# EAGLE design DATALOGGER_BP_V1 (EAGLE 9.5.2)

## Sheet 1 of 4
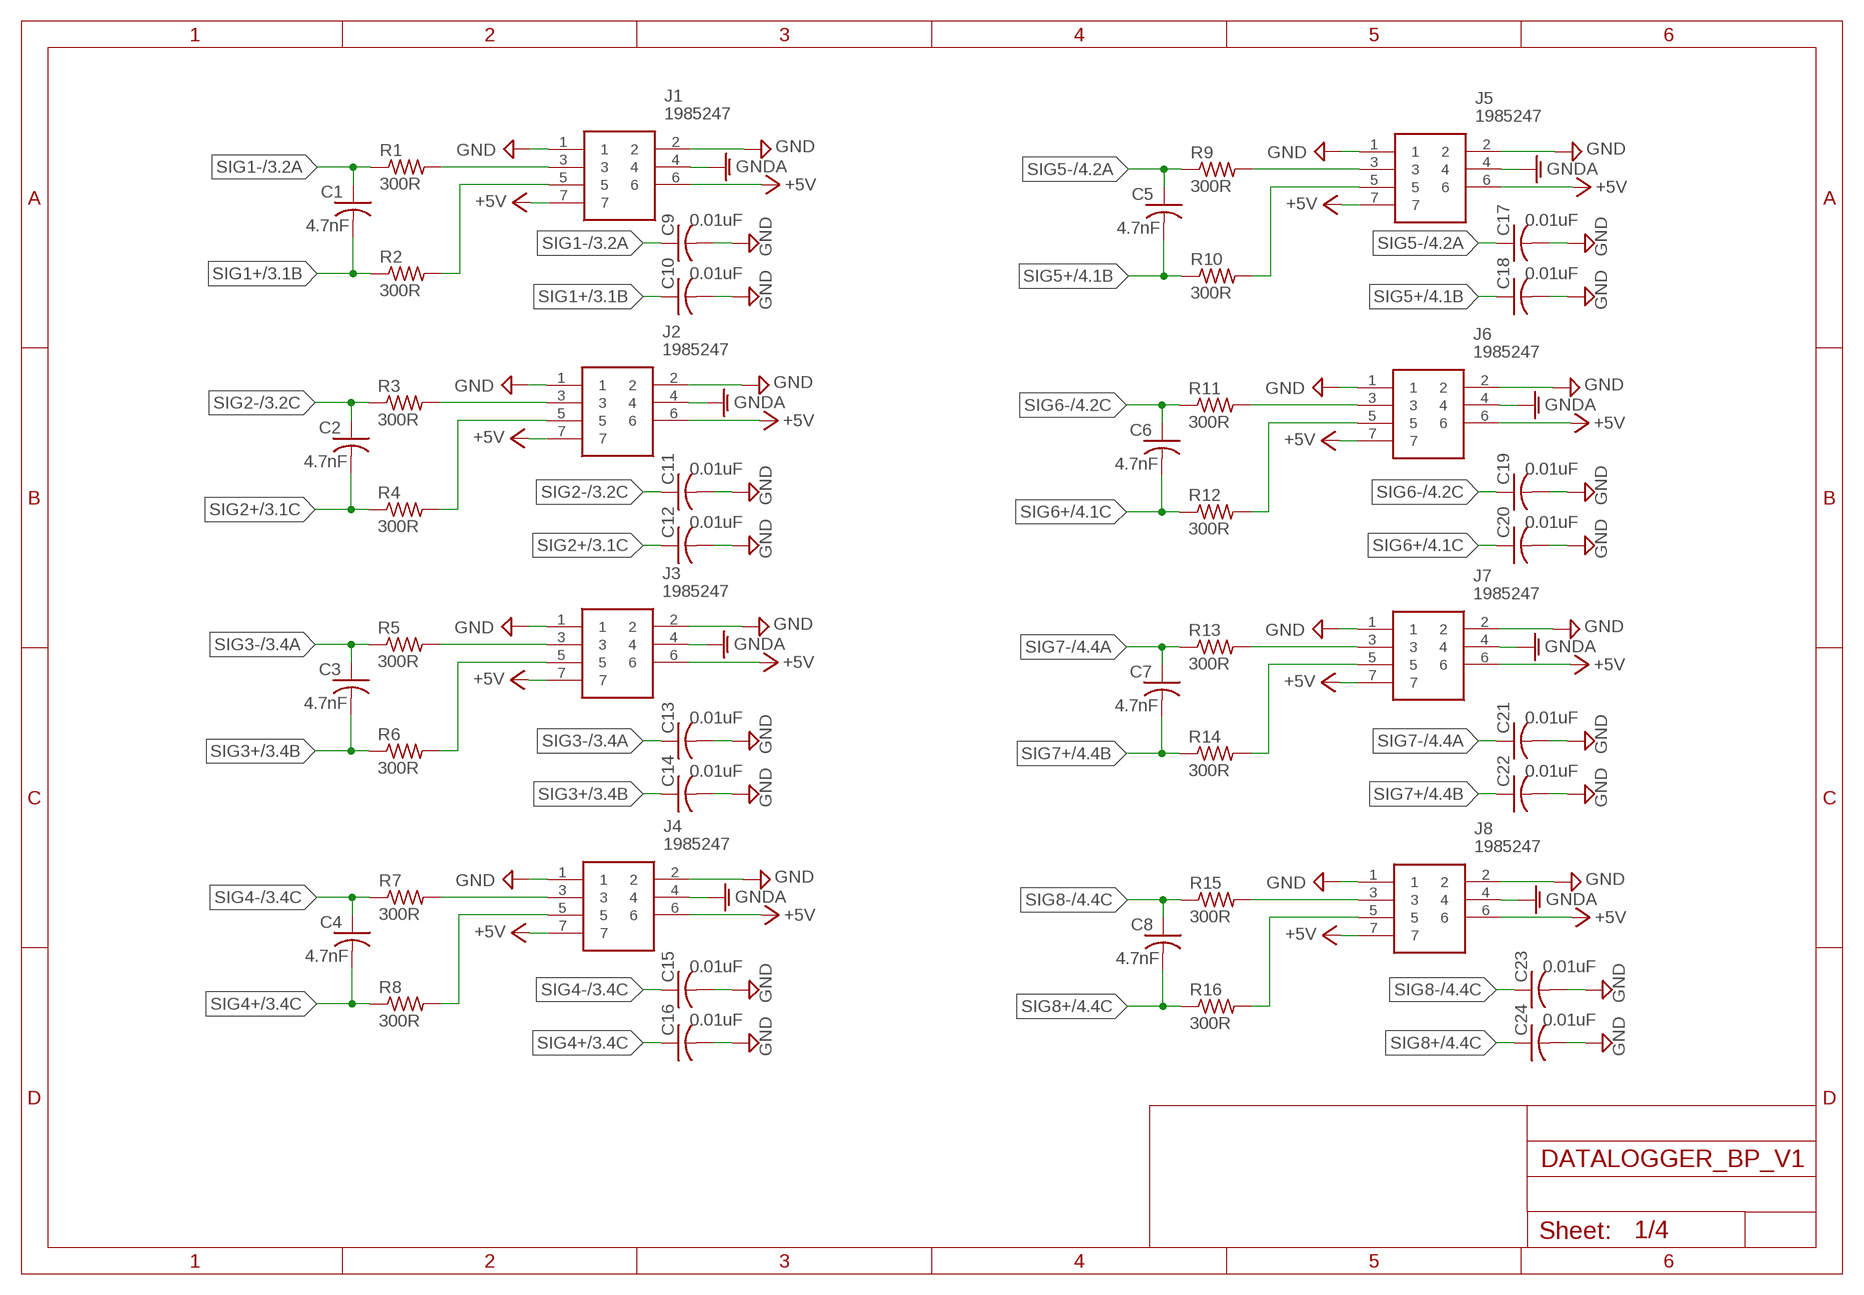
[diagram p0: schematic, sheet 1]

### Parts
C1  4.7nF  C-USC0805  [C0805]
C2  4.7nF  C-USC0805  [C0805]
C3  4.7nF  C-USC0805  [C0805]
C4  4.7nF  C-USC0805  [C0805]
C5  4.7nF  C-USC0805  [C0805]
C6  4.7nF  C-USC0805  [C0805]
C7  4.7nF  C-USC0805  [C0805]
C8  4.7nF  C-USC0805  [C0805]
C9  0.01uF  C-USC0805  [C0805]
C10  0.01uF  C-USC0805  [C0805]
C11  0.01uF  C-USC0805  [C0805]
C12  0.01uF  C-USC0805  [C0805]
C13  0.01uF  C-USC0805  [C0805]
C14  0.01uF  C-USC0805  [C0805]
C15  0.01uF  C-USC0805  [C0805]
C16  0.01uF  C-USC0805  [C0805]
C17  0.01uF  C-USC0805  [C0805]
C18  0.01uF  C-USC0805  [C0805]
C19  0.01uF  C-USC0805  [C0805]
C20  0.01uF  C-USC0805  [C0805]
C21  0.01uF  C-USC0805  [C0805]
C22  0.01uF  C-USC0805  [C0805]
C23  0.01uF  C-USC0805  [C0805]
C24  0.01uF  C-USC0805  [C0805]
J1  1985247  [1985247]
J2  1985247  [1985247]
J3  1985247  [1985247]
J4  1985247  [1985247]
J5  1985247  [1985247]
J6  1985247  [1985247]
J7  1985247  [1985247]
J8  1985247  [1985247]
R1  300R  R-US_R0805  [R0805]
R2  300R  R-US_R0805  [R0805]
R3  300R  R-US_R0805  [R0805]
R4  300R  R-US_R0805  [R0805]
R5  300R  R-US_R0805  [R0805]
R6  300R  R-US_R0805  [R0805]
R7  300R  R-US_R0805  [R0805]
R8  300R  R-US_R0805  [R0805]
R9  300R  R-US_R0805  [R0805]
R10  300R  R-US_R0805  [R0805]
R11  300R  R-US_R0805  [R0805]
R12  300R  R-US_R0805  [R0805]
R13  300R  R-US_R0805  [R0805]
R14  300R  R-US_R0805  [R0805]
R15  300R  R-US_R0805  [R0805]
R16  300R  R-US_R0805  [R0805]

### Nets
+5V: J1.6 J1.7 J2.6 J2.7 J3.6 J3.7 J4.6 J4.7 J5.6 J5.7 J6.6 J6.7 J7.6 J7.7 J8.6 J8.7 ; also sheet 2
GND: C9.2 C10.2 C11.2 C12.2 C13.2 C14.2 C15.2 C16.2 C17.2 C18.2 C19.2 C20.2 C21.2 C22.2 C23.2 C24.2 J1.1 J1.2 J2.1 J2.2 J3.1 J3.2 J4.1 J4.2 J5.1 J5.2 J6.1 J6.2 J7.1 J7.2 J8.1 J8.2 ; also sheet 2,3,4
GNDA: J1.4 J2.4 J3.4 J4.4 J5.4 J6.4 J7.4 J8.4 ; also sheet 2
N$1: J1.3 R1.2
N$2: J1.5 R2.2
N$3: J2.3 R3.2
N$4: J2.5 R4.2
N$5: J3.3 R5.2
N$6: J3.5 R6.2
N$7: J4.3 R7.2
N$8: J4.5 R8.2
N$9: J5.3 R9.2
N$10: J5.5 R10.2
N$11: J6.3 R11.2
N$12: J6.5 R12.2
N$13: J7.3 R13.2
N$14: J7.5 R14.2
N$15: J8.3 R15.2
N$16: J8.5 R16.2
SIG1+: C1.2 C10.1 R2.1 ; also sheet 3
SIG1-: C1.1 C9.1 R1.1 ; also sheet 3
SIG2+: C2.2 C12.1 R4.1 ; also sheet 3
SIG2-: C2.1 C11.1 R3.1 ; also sheet 3
SIG3+: C3.2 C14.1 R6.1 ; also sheet 3
SIG3-: C3.1 C13.1 R5.1 ; also sheet 3
SIG4+: C4.2 C16.1 R8.1 ; also sheet 3
SIG4-: C4.1 C15.1 R7.1 ; also sheet 3
SIG5+: C5.2 C18.1 R10.1 ; also sheet 4
SIG5-: C5.1 C17.1 R9.1 ; also sheet 4
SIG6+: C6.2 C20.1 R12.1 ; also sheet 4
SIG6-: C6.1 C19.1 R11.1 ; also sheet 4
SIG7+: C7.2 C22.1 R14.1 ; also sheet 4
SIG7-: C7.1 C21.1 R13.1 ; also sheet 4
SIG8+: C8.2 C24.1 R16.1 ; also sheet 4
SIG8-: C8.1 C23.1 R15.1 ; also sheet 4

## Sheet 2 of 4
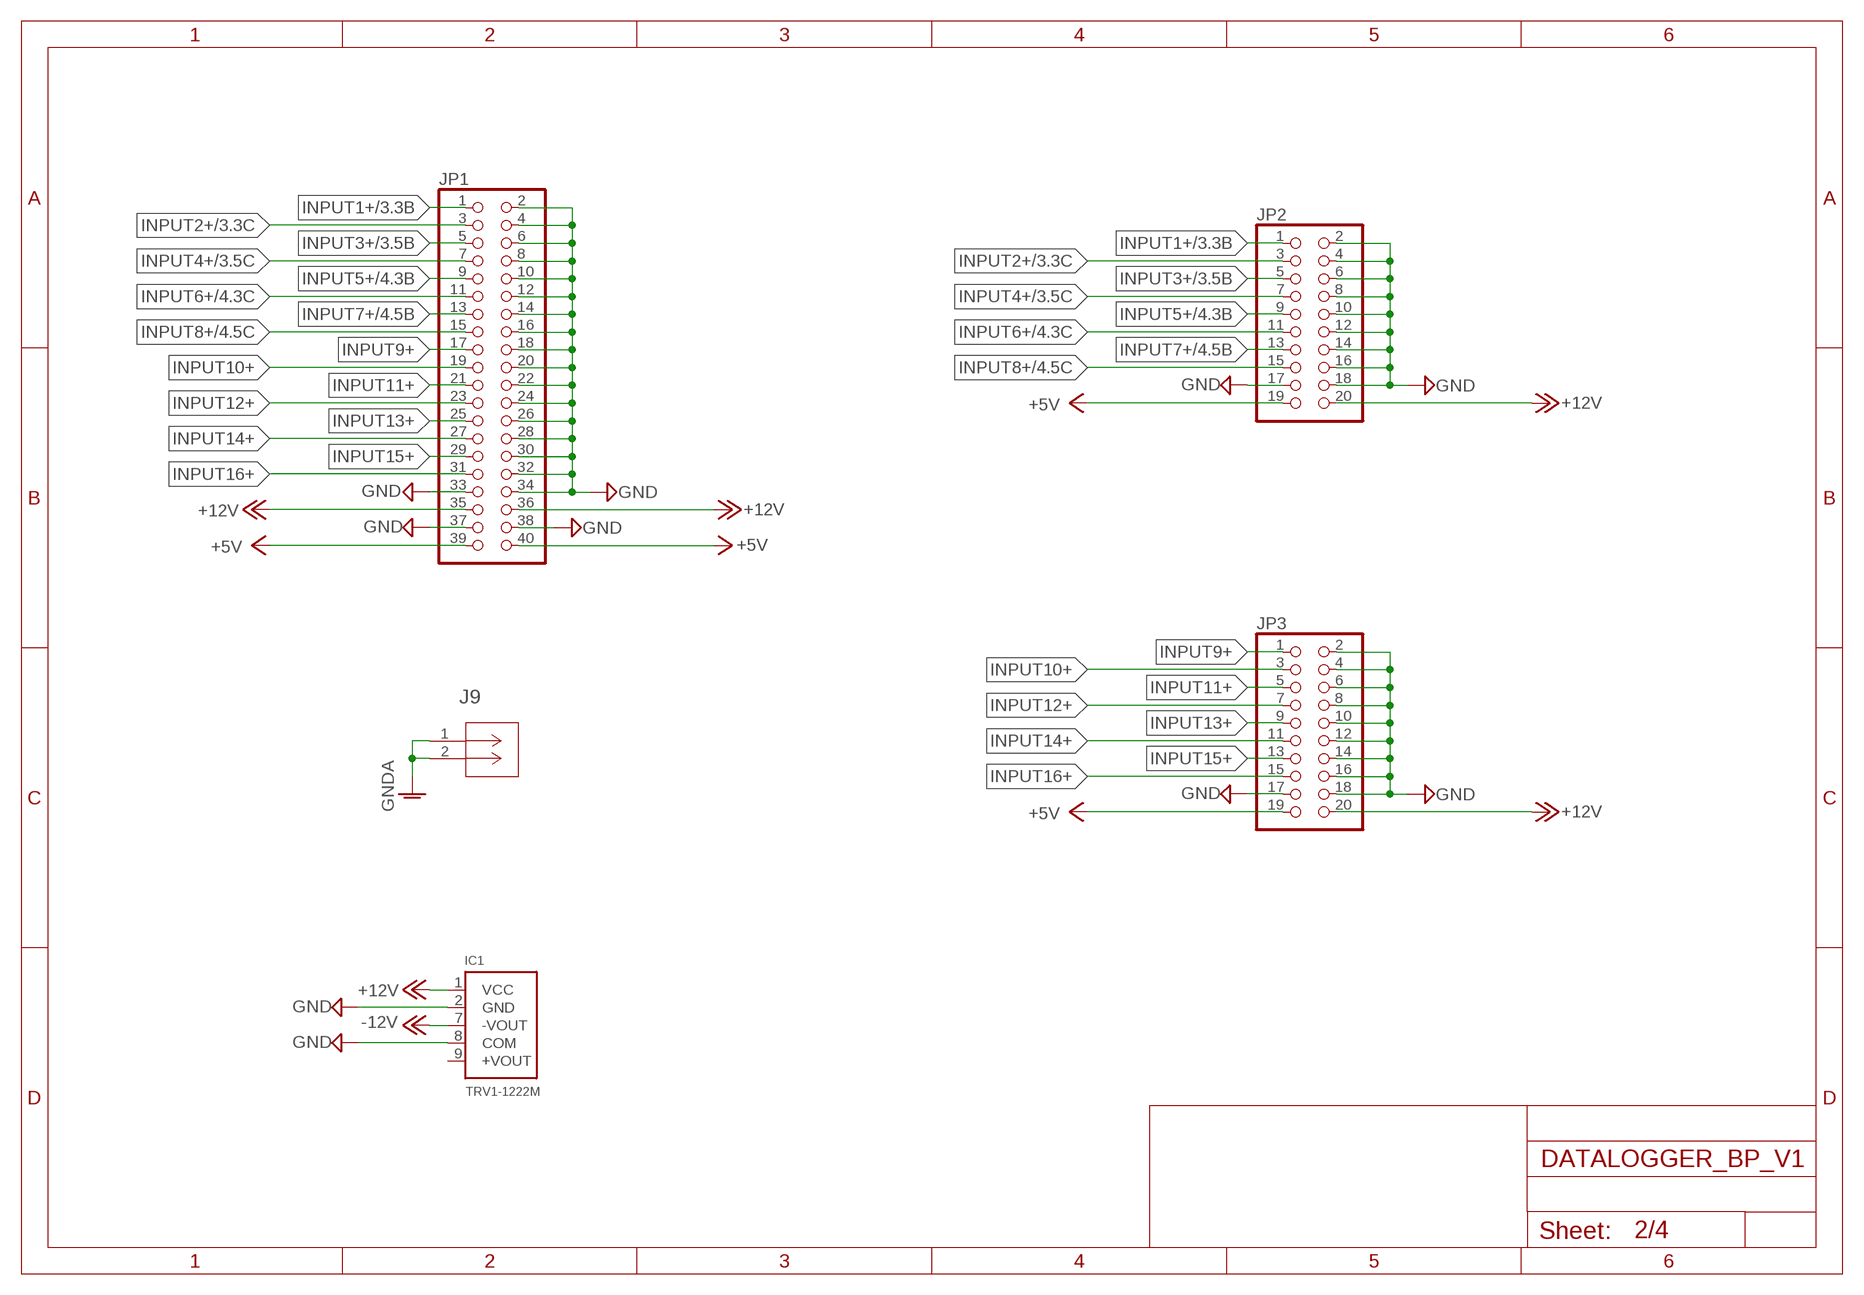
[diagram p1: schematic, sheet 2]

### Parts
IC1  TRV1-1222M  [TRV1-1222M]
J9  1755736  [CONN_1924305]
JP1  PINHD-2X20  [2X20]
JP2  PINHD-2X10  [2X10]
JP3  PINHD-2X10  [2X10]

### Nets
+5V: JP1.39 JP1.40 JP2.19 JP3.19 ; also sheet 1
+12V: IC1.1(VCC) JP1.35 JP1.36 JP2.20 JP3.20 ; also sheet 3,4
-12V: IC1.7(-VOUT) ; also sheet 3,4
GND: IC1.2(GND) IC1.8(COM) JP1.2 JP1.4 JP1.6 JP1.8 JP1.10 JP1.12 JP1.14 JP1.16 JP1.18 JP1.20 JP1.22 JP1.24 JP1.26 JP1.28 JP1.30 JP1.32 JP1.33 JP1.34 JP1.37 JP1.38 JP2.2 JP2.4 JP2.6 JP2.8 JP2.10 JP2.12 JP2.14 JP2.16 JP2.17 JP2.18 JP3.2 JP3.4 JP3.6 JP3.8 JP3.10 JP3.12 JP3.14 JP3.16 JP3.17 JP3.18 ; also sheet 1,3,4
GNDA: J9.1 J9.2 ; also sheet 1
INPUT1+: JP1.1 JP2.1 ; also sheet 3
INPUT2+: JP1.3 JP2.3 ; also sheet 3
INPUT3+: JP1.5 JP2.5 ; also sheet 3
INPUT4+: JP1.7 JP2.7 ; also sheet 3
INPUT5+: JP1.9 JP2.9 ; also sheet 4
INPUT6+: JP1.11 JP2.11 ; also sheet 4
INPUT7+: JP1.13 JP2.13 ; also sheet 4
INPUT8+: JP1.15 JP2.15 ; also sheet 4
INPUT9+: JP1.17 JP3.1
INPUT10+: JP1.19 JP3.3
INPUT11+: JP1.21 JP3.5
INPUT12+: JP1.23 JP3.7
INPUT13+: JP1.25 JP3.9
INPUT14+: JP1.27 JP3.11
INPUT15+: JP1.29 JP3.13
INPUT16+: JP1.31 JP3.15
Unconnected: IC1.9(+VOUT)

## Sheet 3 of 4
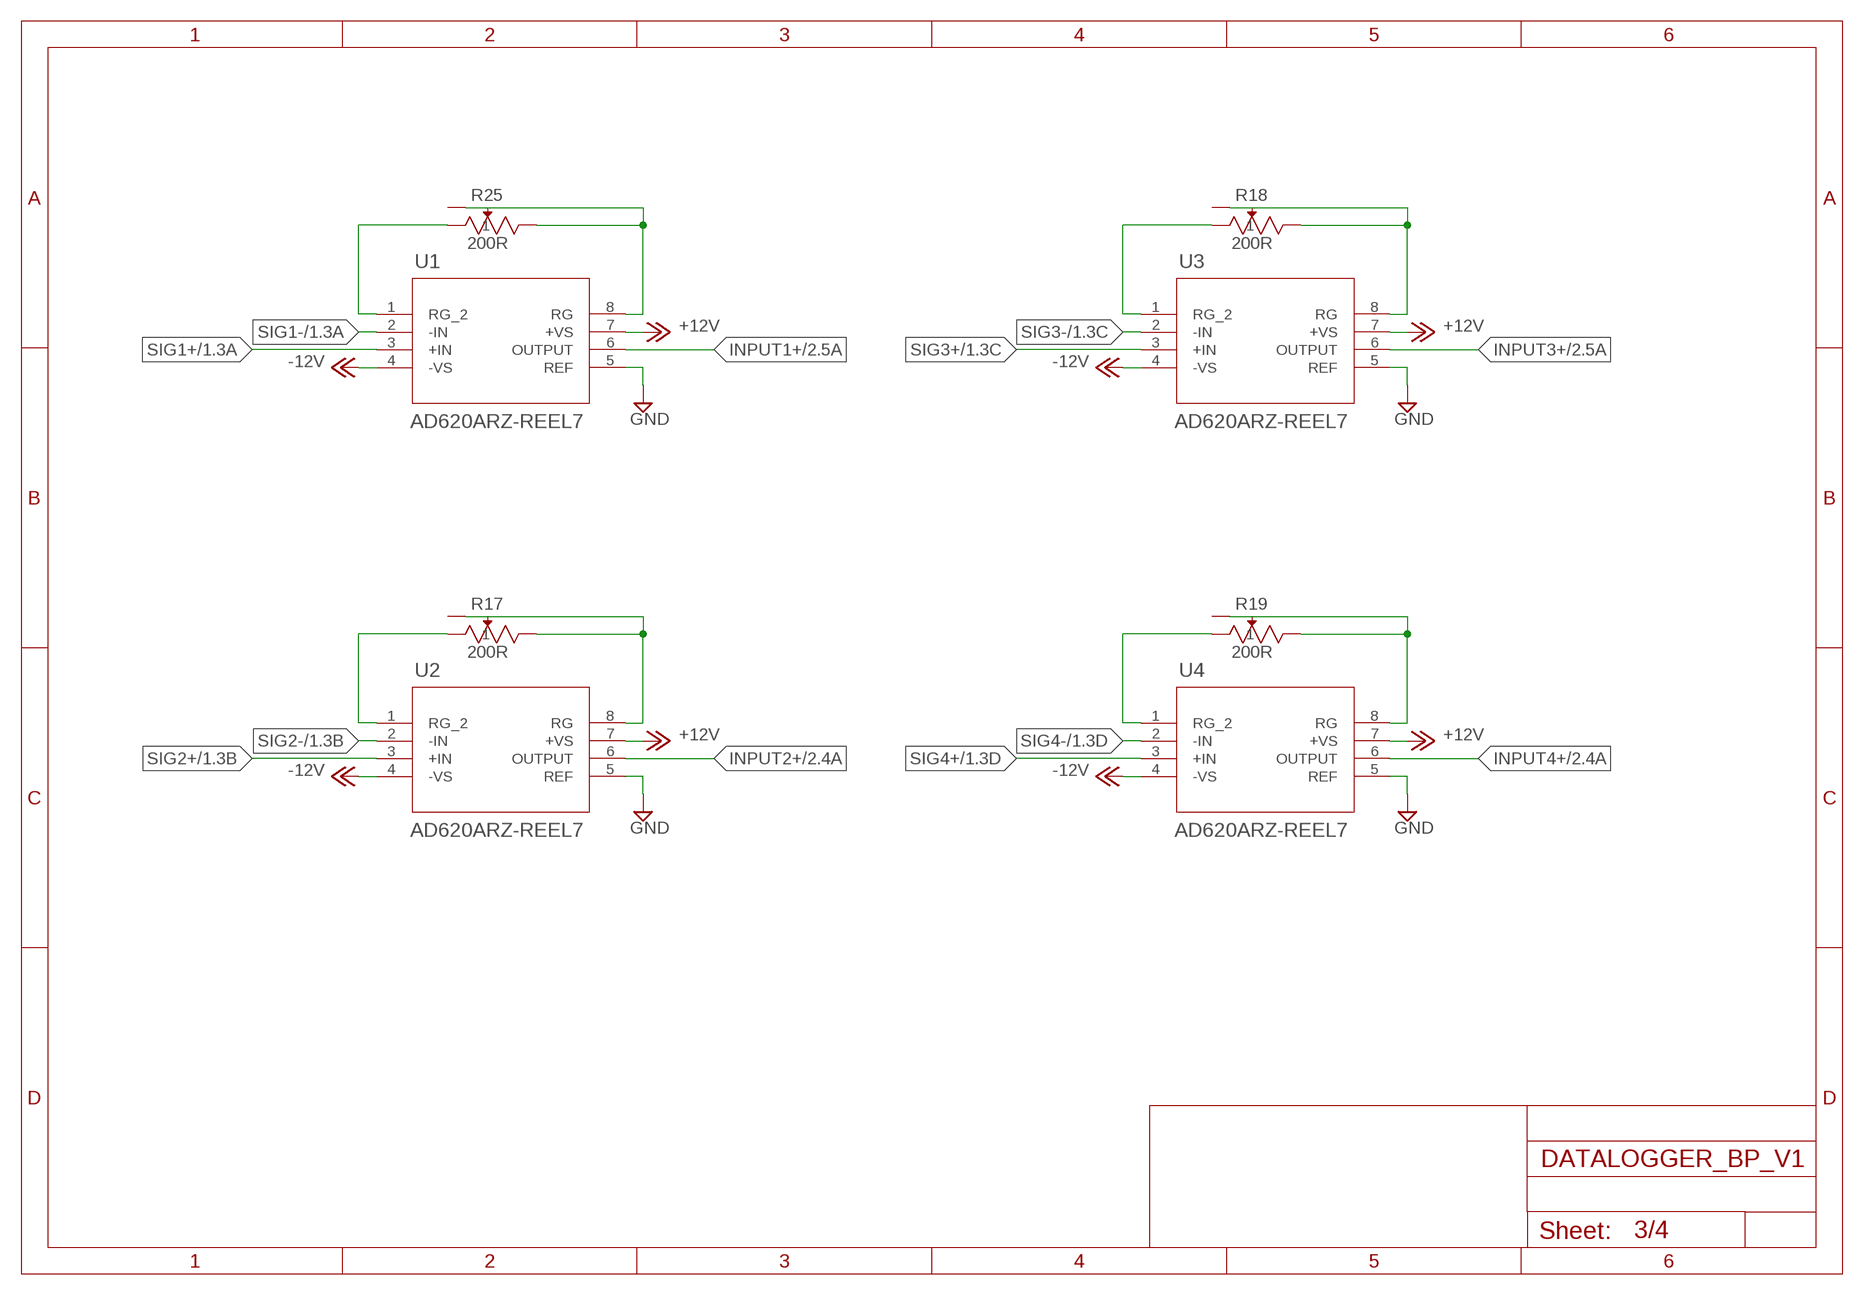
[diagram p2: schematic, sheet 3]

### Parts
R17  200R  22AR200LFTR  [RES3_22A_TTE]
R18  200R  22AR200LFTR  [RES3_22A_TTE]
R19  200R  22AR200LFTR  [RES3_22A_TTE]
R25  200R  22AR200LFTR  [RES3_22A_TTE]
U1  AD620ARZ-REEL7  [R_8_ADI]
U2  AD620ARZ-REEL7  [R_8_ADI]
U3  AD620ARZ-REEL7  [R_8_ADI]
U4  AD620ARZ-REEL7  [R_8_ADI]

### Nets
+12V: U1.7(+VS) U2.7(+VS) U3.7(+VS) U4.7(+VS) ; also sheet 2,4
-12V: U1.4(-VS) U2.4(-VS) U3.4(-VS) U4.4(-VS) ; also sheet 2,4
GND: U1.5(REF) U2.5(REF) U3.5(REF) U4.5(REF) ; also sheet 1,2,4
INPUT1+: U1.6(OUTPUT) ; also sheet 2
INPUT2+: U2.6(OUTPUT) ; also sheet 2
INPUT3+: U3.6(OUTPUT) ; also sheet 2
INPUT4+: U4.6(OUTPUT) ; also sheet 2
N$17: R25.1 U1.1(RG_2)
N$18: R25.2 R25.3 U1.8(RG)
N$19: R17.1 U2.1(RG_2)
N$20: R17.2 R17.3 U2.8(RG)
N$21: R18.1 U3.1(RG_2)
N$22: R18.2 R18.3 U3.8(RG)
N$23: R19.1 U4.1(RG_2)
N$24: R19.2 R19.3 U4.8(RG)
SIG1+: U1.3(+IN) ; also sheet 1
SIG1-: U1.2(-IN) ; also sheet 1
SIG2+: U2.3(+IN) ; also sheet 1
SIG2-: U2.2(-IN) ; also sheet 1
SIG3+: U3.3(+IN) ; also sheet 1
SIG3-: U3.2(-IN) ; also sheet 1
SIG4+: U4.3(+IN) ; also sheet 1
SIG4-: U4.2(-IN) ; also sheet 1

## Sheet 4 of 4
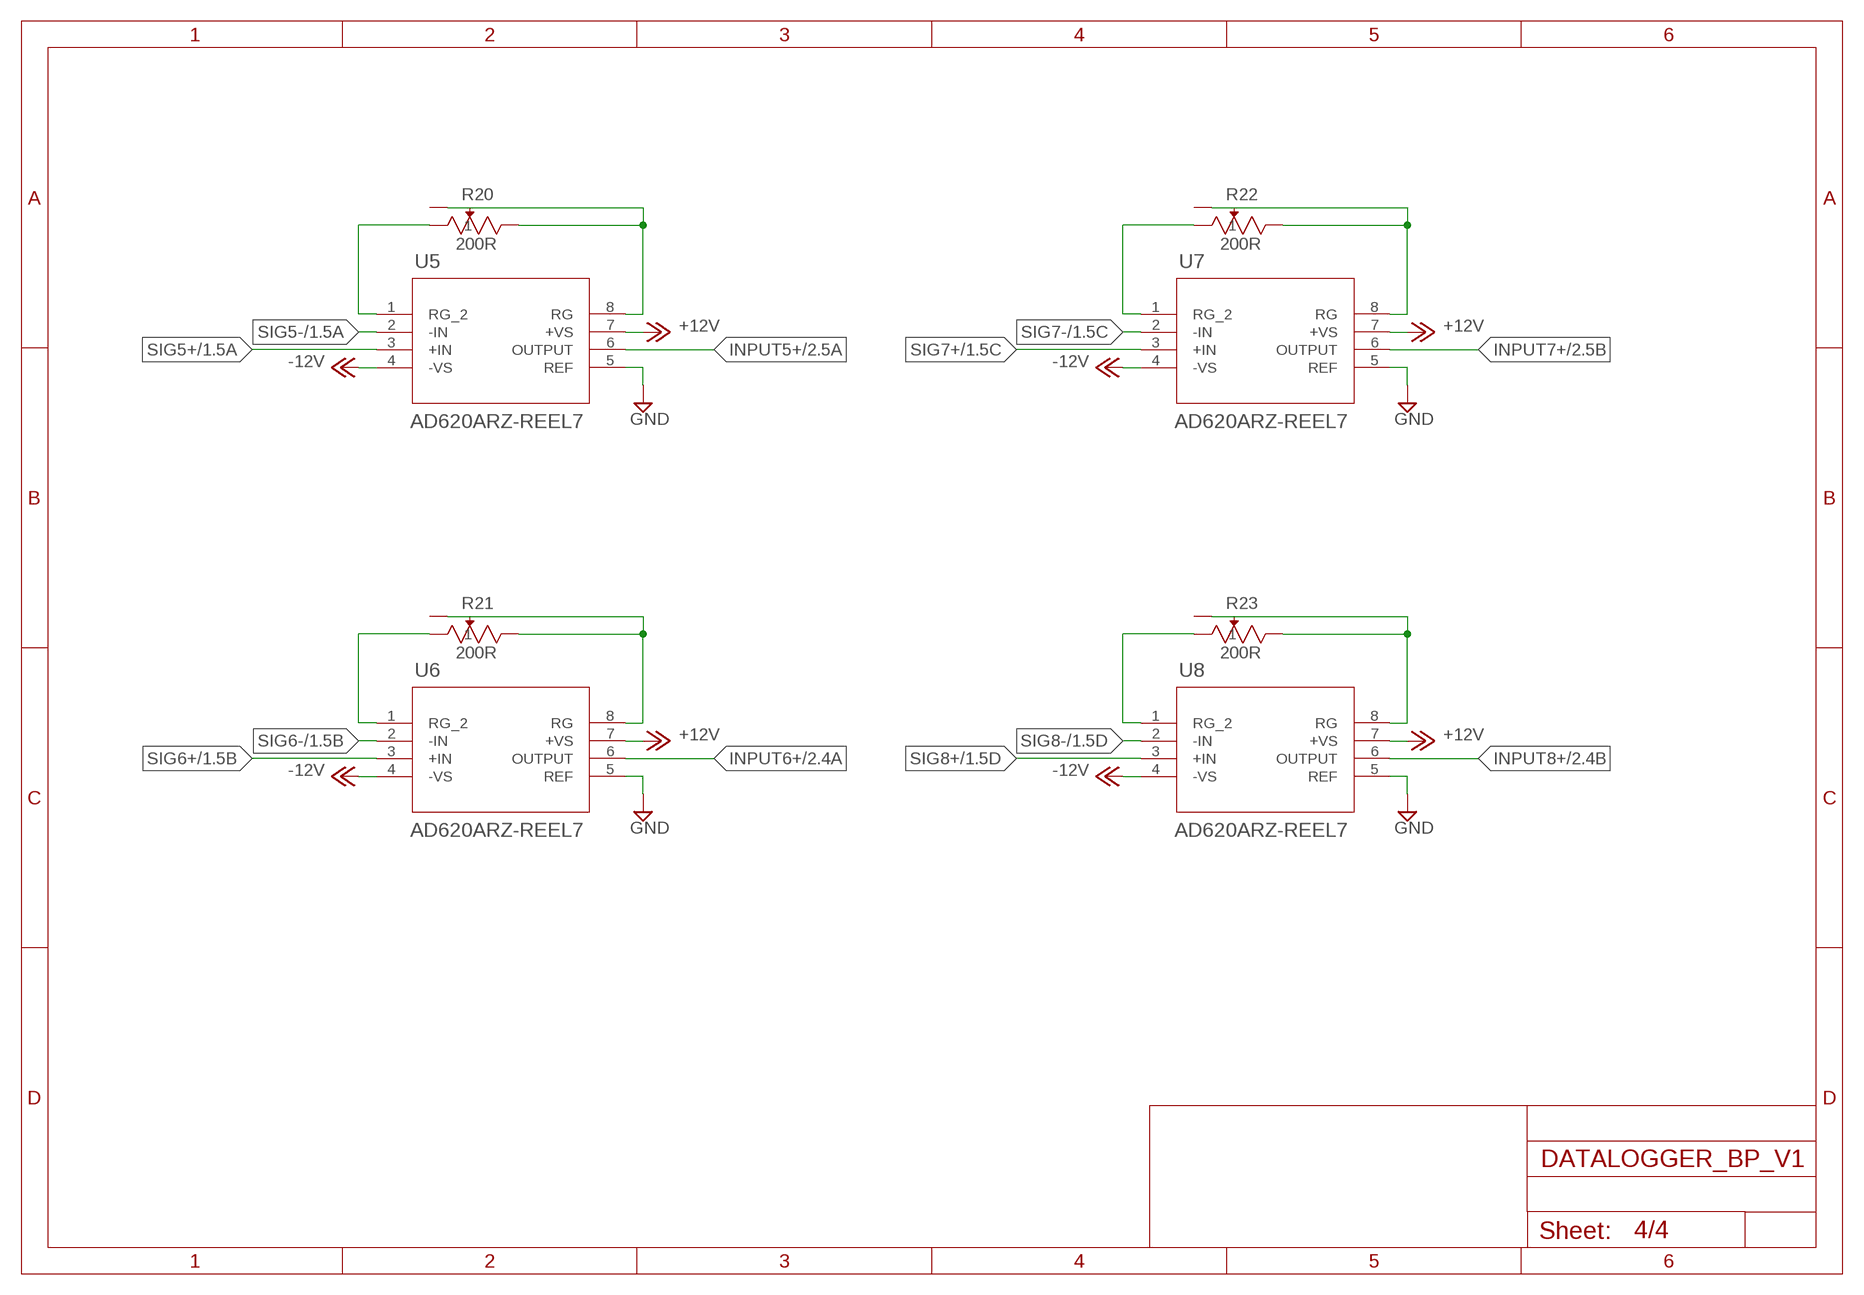
[diagram p3: schematic, sheet 4]

### Parts
R20  200R  22AR200LFTR  [RES3_22A_TTE]
R21  200R  22AR200LFTR  [RES3_22A_TTE]
R22  200R  22AR200LFTR  [RES3_22A_TTE]
R23  200R  22AR200LFTR  [RES3_22A_TTE]
U5  AD620ARZ-REEL7  [R_8_ADI]
U6  AD620ARZ-REEL7  [R_8_ADI]
U7  AD620ARZ-REEL7  [R_8_ADI]
U8  AD620ARZ-REEL7  [R_8_ADI]

### Nets
+12V: U5.7(+VS) U6.7(+VS) U7.7(+VS) U8.7(+VS) ; also sheet 2,3
-12V: U5.4(-VS) U6.4(-VS) U7.4(-VS) U8.4(-VS) ; also sheet 2,3
GND: U5.5(REF) U6.5(REF) U7.5(REF) U8.5(REF) ; also sheet 1,2,3
INPUT5+: U5.6(OUTPUT) ; also sheet 2
INPUT6+: U6.6(OUTPUT) ; also sheet 2
INPUT7+: U7.6(OUTPUT) ; also sheet 2
INPUT8+: U8.6(OUTPUT) ; also sheet 2
N$25: R20.1 U5.1(RG_2)
N$26: R20.2 R20.3 U5.8(RG)
N$27: R21.1 U6.1(RG_2)
N$28: R21.2 R21.3 U6.8(RG)
N$29: R22.1 U7.1(RG_2)
N$30: R22.2 R22.3 U7.8(RG)
N$31: R23.1 U8.1(RG_2)
N$32: R23.2 R23.3 U8.8(RG)
SIG5+: U5.3(+IN) ; also sheet 1
SIG5-: U5.2(-IN) ; also sheet 1
SIG6+: U6.3(+IN) ; also sheet 1
SIG6-: U6.2(-IN) ; also sheet 1
SIG7+: U7.3(+IN) ; also sheet 1
SIG7-: U7.2(-IN) ; also sheet 1
SIG8+: U8.3(+IN) ; also sheet 1
SIG8-: U8.2(-IN) ; also sheet 1

## Library data of the parts
C1-C24 = rcl:C-US: CAPACITOR, American symbol; SPICEPREFIX: C
IC1 = TRV 1-1222M:TRV1-1222M
J1-J8 = SamacSys_Parts:1985247: Fixed Terminal Blocks PTSA 1.5/7-3.5-Z Source: Datasheet <https://www.phoenixcontact.com/online/portal/us?uri=pxc-oc-itemdetail:pid=1985247&library=usen&tab=1>; DESCRIPTION: Fixed Terminal Blocks PTSA 1.5/7-3.5-Z; HEIGHT: 13.1mm; MANUFACTURER_NAME: Phoenix Contact; MANUFACTURER_PART_NUMBER: 1985247; MOUSER_PART_NUMBER: 651-1985247; MOUSER_PRICE-STOCK: https://www.mouser.com/Search/Refine.aspx?Keyword=651-1985247
J9 = 1755736:1755736; ARTICLE_DESCRIPTION: MSTBVA 2,5/ 2-G-5,08; BUILT_BY: EMA_Anthony; CONTACT_TYPE: male connector; COPYRIGHT: Copyright (C) 2018 Accelerated Designs. All rights reserved; MANUFACTURER_PART_NUMBER: 1755736; NUMBER_OF_CONNECTION: 2; NUMBER_OF_POSITION_PER_ROW: 2; NUMBER_OF_POTENTIALS: 2; NUMBER_OF_ROWS: 1; NUMBER_OF_SOLDER_PINS_PER_POTENTIALS: 1; PITCH__MM_: 5.08; PLUG_SYSTEM: CLASSIC COMBICON; PRODUCTTYP: PCB headers; PRODUCT_FAMILY: MSTBVA 2,5/..-G; SOLDER_PIN_LENGTH__MM_: 3.9; SOURCELIBRARY: Phoenix_Contact_2020-08-21; VENDOR: Phoenix Contact
JP1 = pinhead:PINHD-2X20: PIN HEADER
JP2 JP3 = pinhead:PINHD-2X10: PIN HEADER
R1-R16 = rcl:R-US_: RESISTOR, American symbol; SPICEPREFIX: R
R17-R23 R25 = 22AR200LFTR:22AR200LFTR; COPYRIGHT: Copyright (C) 2016 Accelerated Designs. All rights reserved; MANUFACTURER_PART_NUMBER: 22AR200LFTR; SOURCELIBRARY: TTELECTRONICS_2018-04-11; VENDOR: TT Electronics
U1-U8 = AD620ARZ-REEL7:AD620ARZ-REEL7; BUILT_BY: EMA_UL_Team; MANUFACTURER_PART_NUMBER: AD620ARZ-REEL7; SOURCELIBRARY: Analog_2012-01-01_3; VENDOR: Analog Devices Inc

## Board
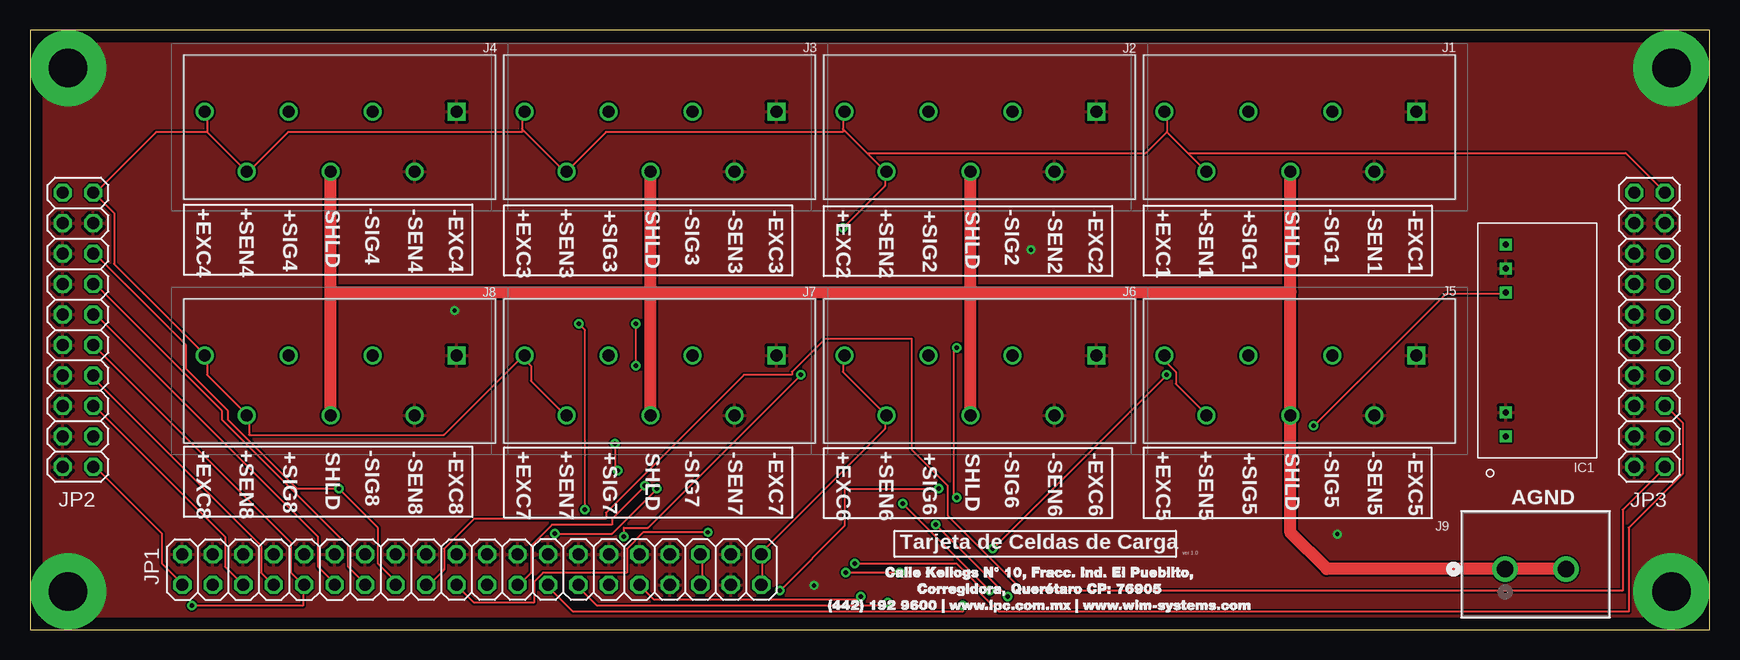
[diagram p4: board, top side]
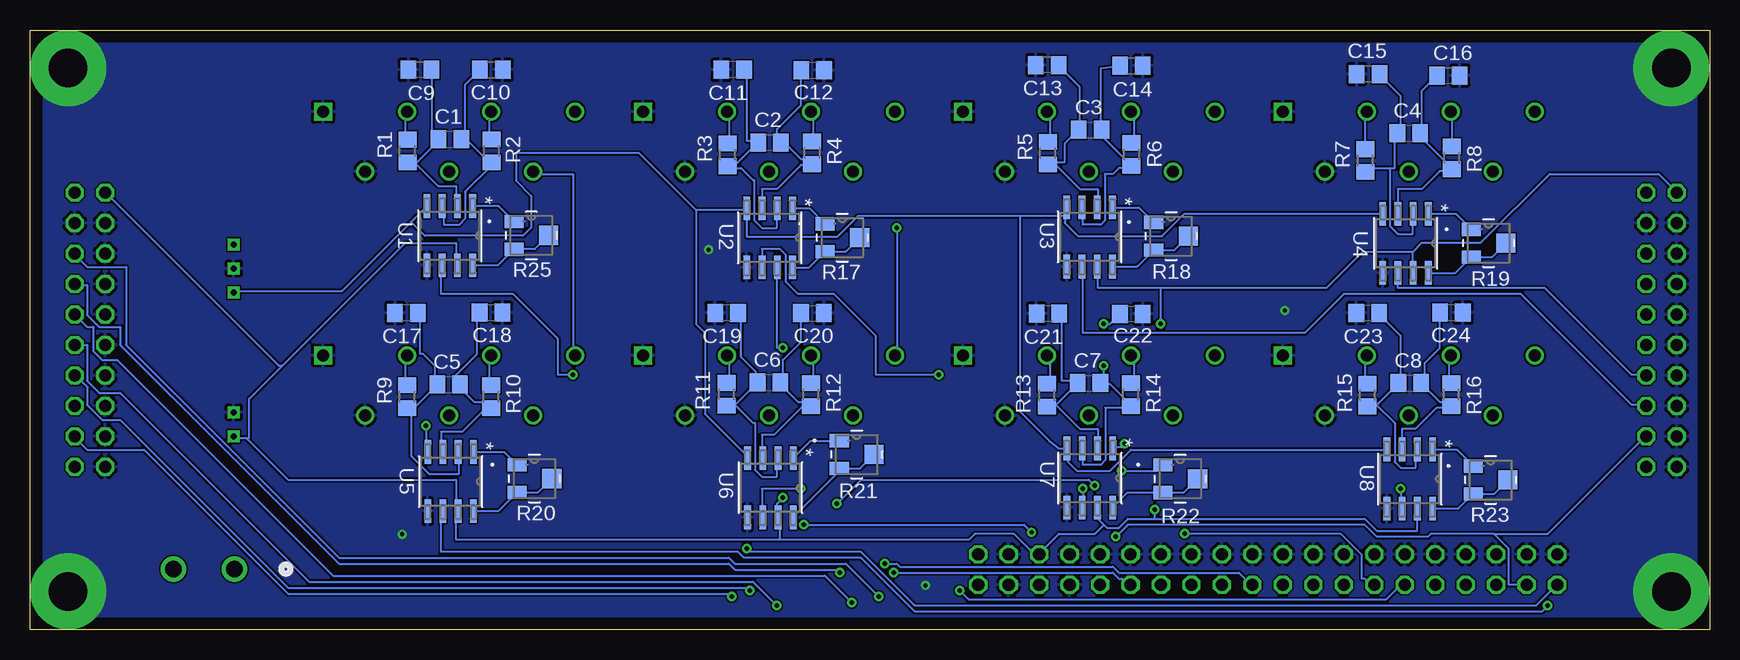
[diagram p5: board, bottom side, seen from below]

Size 140 x 50 mm. Coordinates in mm from the lower left corner, seen from the top.
Outline: 0,0 140,0 140,50 0,50 0,0
Copper layers (1*16): Top 0.035mm / dielectric 12mil / Bottom 0.035mm
Design rules "default *": minimum track width 6mil, minimum drill 0.35mm, track to track 6mil, track to pad 6mil, pad to pad 6mil, via to via 6mil, smd to smd 6mil, copper to edge 40mil, drill to drill 6mil, minimum pad ring 10mil, minimum via ring 8mil, stop-mask expansion 4mil, vias tented up to drill 0mil, thermal gap 10mil

### Footprints (pad centres in the part's own frame; a part is rotated, then mirrored left to right if it is on the bottom)
C0805 = smd 1.3 x 1.5: 1 -0.95,0; 2 0.95,0
TRV1-1222M = drill 0.5 square: 1 1.8,7.6; 2 3.8,7.6; 7 13.8,7.6; 8 15.8,7.6; 9 17.8,7.6
1985247 = drill 1 pad 1.5 square: 1 0,0 | drill 1 pad 1.5: 2 3.5,5; 3 7,0; 4 10.5,5; 5 14,0; 6 17.5,5; 7 21,0
CONN_1924305 = drill 1.397 pad 1.905: 1 -5.08,0; 2 0,0
2X20 = drill 1.016 octagon: 1 -24.13,-1.27; 2 -24.13,1.27; 3 -21.59,-1.27; 4 -21.59,1.27; 5 -19.05,-1.27; 6 -19.05,1.27; 7 -16.51,-1.27; 8 -16.51,1.27; 9 -13.97,-1.27; 10 -13.97,1.27; 11 -11.43,-1.27; 12 -11.43,1.27; 13 -8.89,-1.27; 14 -8.89,1.27; 15 -6.35,-1.27; 16 -6.35,1.27; 17 -3.81,-1.27; 18 -3.81,1.27; 19 -1.27,-1.27; 20 -1.27,1.27; 21 1.27,-1.27; 22 1.27,1.27; 23 3.81,-1.27; 24 3.81,1.27; 25 6.35,-1.27; 26 6.35,1.27; 27 8.89,-1.27; 28 8.89,1.27; 29 11.43,-1.27; 30 11.43,1.27; 31 13.97,-1.27; 32 13.97,1.27; 33 16.51,-1.27; 34 16.51,1.27; 35 19.05,-1.27; 36 19.05,1.27; 37 21.59,-1.27; 38 21.59,1.27; 39 24.13,-1.27; 40 24.13,1.27
2X10 = drill 1.016 octagon: 1 -11.43,-1.27; 2 -11.43,1.27; 3 -8.89,-1.27; 4 -8.89,1.27; 5 -6.35,-1.27; 6 -6.35,1.27; 7 -3.81,-1.27; 8 -3.81,1.27; 9 -1.27,-1.27; 10 -1.27,1.27; 11 1.27,-1.27; 12 1.27,1.27; 13 3.81,-1.27; 14 3.81,1.27; 15 6.35,-1.27; 16 6.35,1.27; 17 8.89,-1.27; 18 8.89,1.27; 19 11.43,-1.27; 20 11.43,1.27
R0805 = smd 1.3 x 1.5: 1 -0.95,0; 2 0.95,0
RES3_22A_TTE = smd 1.6 x 1.092: 1 -1.448,1.156; 2 -1.448,-1.156 | smd 1.6 x 1.6: 3 1.448,0
R_8_ADI = smd 1.981 x 0.559: 1 -2.464,1.905; 2 -2.464,0.635; 3 -2.464,-0.635; 4 -2.464,-1.905; 5 2.464,-1.905; 6 2.464,-0.635; 7 2.464,0.635; 8 2.464,1.905

### Placement (x,y rotation side)
C1  105,40.89 0 bottom
C2  78.35,40.62 0 bottom
C3  51.62,41.67 0 bottom
C4  25.07,41.39 0 bottom
C5  105.1,20.44 0 bottom
C6  78.41,20.61 0 bottom
C7  51.72,20.55 0 bottom
C8  24.99,20.55 0 bottom
C9  107.51,46.67 180 bottom
C10  101.54,46.69 0 bottom
C11  81.43,46.69 180 bottom
C12  74.76,46.65 0 bottom
C13  55.21,47.08 180 bottom
C14  48.18,47.02 0 bottom
C15  28.46,46.32 180 bottom
C16  21.77,46.2 0 bottom
C17  108.62,26.4 180 bottom
C18  101.57,26.43 0 bottom
C19  81.93,26.4 180 bottom
C20  74.78,26.38 0 bottom
C21  55.14,26.34 180 bottom
C22  48.2,26.33 0 bottom
C23  28.49,26.38 180 bottom
C24  21.51,26.43 0 bottom
IC1  130.61,14.31 90 top
J1  115.57,43.18 180 top
J2  88.9,43.18 180 top
J3  62.23,43.18 180 top
J4  35.56,43.18 180 top
J5  115.57,22.86 180 top
J6  88.9,22.86 180 top
J7  62.23,22.86 180 top
J8  35.56,22.86 180 top
J9  128.04,5.04 0 top
JP1  36.83,5 0 top
JP2  4,25 90 top
JP3  135,25 90 top
R1  108.54,39.9 90 bottom
R2  101.52,39.92 90 bottom
R3  81.86,39.59 90 bottom
R4  74.8,39.76 90 bottom
R5  55.16,39.73 90 bottom
R6  48.18,39.62 90 bottom
R7  28.7,39.11 90 bottom
R8  21.48,39.34 90 bottom
R9  108.56,19.42 90 bottom
R10  101.56,19.41 90 bottom
R11  81.93,19.61 90 bottom
R12  74.89,19.58 90 bottom
R13  55.22,19.53 90 bottom
R14  48.24,19.59 90 bottom
R15  28.51,19.55 90 bottom
R16  21.52,19.58 90 bottom
R17  72.29,32.68 0 bottom
R18  44.88,32.8 0 bottom
R19  18.41,32.22 0 bottom
R20  97.96,12.59 0 bottom
R21  71.09,14.59 0 bottom
R22  44.12,12.57 0 bottom
R23  18.25,12.47 0 bottom
R25  98.21,32.87 0 bottom
U1  105,32.84 270 bottom
U2  78.35,32.66 270 bottom
U3  51.68,32.74 270 bottom
U4  25.34,32.21 270 bottom
U5  104.94,12.34 270 bottom
U6  78.28,11.82 270 bottom
U7  51.65,12.64 270 bottom
U8  24.99,12.55 270 bottom

### Tracks (layer width: path | path; a pad name or v marks a point on that pad's centre or on a via)
+5V  (via drill 0.35)
  Top 0.152: J5.6 98,18 95.5,20.5 95.5,21.5 94.75,22.25 94.75,22.75 J5.7 | 94.75,41.5 96.5,39.75 | 96.5,39.75 J1.6 | 94.75,41.5 94.75,43 J1.7 | 96.5,39.75 133,39.75 136.25,36.5 JP3.19 | J7.6 44.5,18 41.75,20.75 41.75,22 41.25,22.5 41.25,22.75 J7.7 41,22.75 34.5,16.25 18.25,16.25 18.25,17.75 J8.6 18,18 14.75,21.25 14.75,22.75 J8.7 14.5,23 7,30.5 7,34.75 5.5,36.25 JP2.19 5.5,36.5 10.5,41.5 14.75,41.5 | 14.75,41.5 18,38.25 J4.6 18.25,38.25 21.5,41.5 41,41.5 41,41.75 | 14.75,41.5 14.75,43 J4.7 | JP1.39 61,3.75 61,6.25 JP1.40 61,6.5 71.25,16.75 71.25,17.75 J6.6 71.25,18 67.75,21.5 67.75,22.75 J6.7 | 41,41.75 44.5,38.25 J3.6 44.75,38.25 48,41.5 67.75,41.5 67.75,41.75 | 41,41.75 41,43 J3.7 | 67.75,41.75 69.75,39.75 | 69.75,39.75 71.25,38.25 J2.6 71.25,38 71.25,37 v67.75,33.5 | 67.75,41.75 67.75,43 J2.7 | 94.75,41.5 93,39.75 69.75,39.75
  Bottom 0.152: J5.7 94.75,23 94.75,38 98,38 J1.6 | v67.75,33.5 67.75,23 J6.7
+12V  (via drill 0.35)
  Top 0.152: v77.25,23.5 77,23.25 77,11.25 v77.25,11 | JP1.35 56,3.75 56,6.25 JP1.36 | v45.75,25.5 46.25,25 v46.25,10
  Bottom 0.152: 122,16 118.5,12.5 104.5,12.5 104.5,10 U5.7 104.5,9.75 104.5,7.5 77.5,7.5 | 122,16 123,16 IC1.1 | 119,22 121.75,19.25 121.75,16 122,16 | 119,22 108.75,32.25 104.5,32.25 104.5,30.5 U1.7 | 119,22 119.25,22 133.5,36.25 JP3.20 | 24.75,31.5 24.75,29.75 U4.7 | JP2.20 2.75,36.5 4.25,38 13.32,38 19.06,32.26 23.99,32.26 24.75,31.5 | 45.75,28.5 31.95,28.5 28.95,31.5 24.75,31.5 | 45.75,28.5 51,28.5 51,30.25 U3.7 | 46.25,9.25 48.5,9.25 49.25,8.5 50.25,8.5 50.5,8.75 | 46.25,9.25 28.75,9.25 27.75,8.25 24.36,8.25 U8.7 | 50.5,8.75 51,9.25 51,10 U7.7 | 77.5,7.5 77.5,9.25 U6.7 77.75,9.5 77.75,10.5 v77.25,11 | 77.5,7.5 61.75,7.5 61.25,8 58,8 56.5,6.5 56,6.5 JP1.36 55.75,6.5 54.25,8 51.25,8 50.5,8.75 | v77.25,23.5 77.75,23.5 77.75,30 U2.7 | v45.75,25.5 45.75,28.5 | 46.25,9.25 v46.25,10
-12V  (via drill 0.35)
  Top 0.152: v107,17 118,28 123,28 IC1.7
  Bottom 0.152: v107,17 107,15 U5.4 | 108.25,34 114,28.25 123,28.25 IC1.7 | 108.25,34 107,35.25 U1.4 | U8.4 27,15 48.25,15 50,13.25 52.75,13.25 53.5,14 53.5,15 U7.4 54.23,15.1 55.03,15.72 57.5,18.19 57.5,34.5 | 84.5,35 84.5,25.5 83.75,24.75 83.75,18 80.25,14.5 U6.4 | 84.5,35 80.5,35 U2.4 80.25,35 80.25,32.75 72.75,32.75 71,34.5 57.5,34.5 | 53.75,34.5 53.75,35 U3.4 53.75,34.5 | 53.75,34.5 53.75,33.91 52.64,32.8 45.63,32.8 43.75,34.67 U4.4 | 53.75,34.5 57.5,34.5 | 108.25,34 107.09,32.84 98.9,32.84 98.22,33.51 98.22,36.17 99.5,37.44 99.5,39.75 89.25,39.75 84.5,35
GND  (via drill 0.35, 3.2 pad 6.35)
  other vias: 3.18,3.18 3.18,46.82 136.82,46.82 136.82,3.18 83.44,31.67 108.98,7.95 65.35,3.67 35.41,26.59
  pour Top: 140,0 0,0 0,50 140,50
  pour Bottom: 0,50 0,0 140,0 140,50
GNDA
  Top 0.152: 51.73,28 51.75,28 51.75,28.16 | 78,28.16 78,28.25 78.4,28.25
  Top 1.016: J8.4 25.06,28.16 | 25.06,28.16 J4.4 | J7.4 51.73,28 J3.4 | J6.4 78.4,28.25 J2.4 | 105.07,28.16 J5.4 105.07,8.06 108.09,5.04 J9.1 J9.2 | 105.07,28.16 J1.4 | 25.06,28.16 51.75,28.16 78,28.16 105.07,28.16
INPUT1+  (via drill 0.35)
  Top 0.152: v80.25,6.75 v94.75,21.25 | JP2.1 5.5,13.5 11,8 11,5.5 12.5,4 12.5,3.75 JP1.1
  Bottom 0.152: v94.75,21.25 96,21.25 96,24.25 99.75,28 105.75,28 105.75,30.25 U1.6 | v80.25,6.75 80,6.5 70.75,6.5 66.25,2 14.5,2 13,3.5 12.75,3.5 JP1.1
INPUT2+  (via drill 0.35)
  Top 0.152: v64.25,21.25 51.5,8.5 49.5,8.5 v49.5,7.75
  Bottom 0.152: v64.25,21.25 69.5,21.25 69.5,24.5 73,28 76,28 77,29 77,31.25 77.5,31.75 79,31.75 79,30.25 U2.6 | v49.5,7.75 48.5,8.75 28.75,8.75 27.75,7.75 23.5,7.75 23.25,8 18,8 | 18,8 16.75,6.75 16.75,3.75 15.25,3.75 JP1.3 | 18,8 13.5,8 5.5,16 JP2.3
INPUT3+
  Top 0.152: JP1.5 17.75,3.75 16.25,5.25 16.25,7.75 5.5,18.5 JP2.5
  Bottom 0.152: U3.6 52.25,30.25 52.25,24.75 33.75,24.75 30.5,28 15.75,28 6.5,18.75 5.5,18.75 JP2.5
INPUT4+
  Top 0.152: JP1.7 20.25,3.75 19.25,4.75 19.25,7 5.5,20.75 5.5,21 JP2.7
  Bottom 0.152: U4.6 26,29.5 26,28.5 13.75,28.5 6.5,21.25 5.5,21.25 JP2.7
INPUT5+  (via drill 0.35)
  Top 0.152: v13.5,2 22.75,2 22.75,3.5 JP1.9 22.75,3.75 21.75,4.75 21.75,7.25 JP2.9
  Bottom 0.152: v13.5,2 14,1.5 66.25,1.5 70.75,6 80.5,6 81,6.5 105.75,6.5 105.75,9.75 U5.6
INPUT6+  (via drill 0.35)
  Top 0.152: v75.75,11.75 67.93,11.75 67.93,8.68 v62.5,3.25 | JP2.11 5.5,26.25 24,7.75 24,5.25 25.25,4 25.25,3.75 JP1.11
  Bottom 0.152: v75.75,11.75 79,11.75 79,9.5 U6.6 | v62.5,3.25 61.75,2.5 27,2.5 26,3.5 25.5,3.5 JP1.11
INPUT7+  (via drill 0.35)
  Top 0.152: v52.25,11.75 48.5,8 v43.75,8 | JP2.13 5.5,28.75 16,18.25 16,17.5 26.5,7 26.5,5.25 27.75,4 27.75,3.75 JP1.13
  Bottom 0.152: v52.25,11.75 52.25,10.25 U7.6 | v43.75,8 30.75,8 29,6.25 29,4.25 28.75,4.25 28.25,3.75 28,3.75 JP1.13
INPUT8+  (via drill 0.35)
  Top 0.152: JP1.15 30.25,3.75 30.25,4.25 29,5.5 29,8.5 v25.75,11.75 22.25,11.75 16.5,17.5 16.5,18.25 13,21.75 13,23.75 5.5,31.25 JP2.15
  Bottom 0.152: v25.75,11.75 25.75,10.25 U8.6
INPUT9+
  Top 0.152: JP1.17 33.25,3.75 34.5,5 34.5,6.75 37,9.25 48,9.25 48,9.75 59.5,21.25 63.5,21.25 63.5,21.5 66.25,24.25 73.5,24.25 73.5,15 76.5,12 76.5,9.5 82.75,3.25 132.75,3.25 132.75,10 136.25,13.5 JP3.1
INPUT10+  (via drill 0.35)
  Top 0.152: v56.51,8.11 51.11,8.11 49.75,6.75 49.75,4.75 42.75,4.75 42,4 42,2.25 37,2.25 35.75,3.5 JP1.19 | v81.5,2.75 v75.5,8.75
  Bottom 0.152: v56.51,8.11 57.14,8.75 v75.5,8.75 | v81.5,2.75 81.75,3 118.5,3 130.5,15 135.25,15 136.25,16 JP3.3
INPUT11+  (via drill 0.35)
  Top 0.152: v68.75,5.5 77.25,5.5 79.25,3.5 79.25,3 80.75,1.5 133.25,1.5 133.25,8.5 137.75,13 137.75,17.25 136.5,18.5 JP3.5
  Bottom 0.152: v68.75,5.5 67.75,5.5 67.5,5.25 49.75,5.25 49.25,4.75 39.25,4.75 38.25,3.75 JP1.21
INPUT12+  (via drill 0.35)
  Top 0.152: v51.25,12 48.5,9.25 48.5,8.75 43.5,8.75 41.75,7 41.75,4.75 40.75,3.75 JP1.23 | v80,3.25 v72.75,10.5
  Bottom 0.152: v51.25,12 51.75,12.5 70.75,12.5 v72.75,10.5 | v80,3.25 80.25,3.5 118.5,3.5 132.5,17.5 134,17.5 135.25,18.75 135.25,20.25 136,21 136.25,21 JP3.7
INPUT13+  (via drill 0.35)
  Top 0.152: v77.75,2 77.75,1.5 45.25,1.5 43.25,3.5 JP1.25
  Bottom 0.152: v77.75,2 79.75,4 116.75,4 132.5,19.75 134.25,19.75 135.25,20.75 135.25,23.75 136.25,23.75 JP3.9
INPUT14+  (via drill 0.35)
  Top 0.152: v71.5,2.25 71.5,2 47.25,2 45.75,3.5 JP1.27
  Bottom 0.152: v71.5,2.25 73.75,4.5 114.75,4.5 132.75,22.5 134,22.5 134.75,23.25 134.75,25.25 135.25,25.25 JP3.11
INPUT15+  (via drill 0.35)
  Top 0.152: v72.5,4.75 v68,4.75
  Bottom 0.152: v68,4.75 49.75,4.75 49.25,4.25 49,4.25 48.5,3.75 JP1.29 | v72.5,4.75 72.75,5 81.25,5 81.75,5.5 114.25,5.5 132.5,23.75 132.5,25.25 134.25,25.25 135.25,26.25 135.25,28.75 136.25,28.75 JP3.13
INPUT16+  (via drill 0.35)
  Top 0.152: v69.25,2.75 69.25,2.5 52,2.5 51,3.5 JP1.31
  Bottom 0.152: v69.25,2.75 72,5.5 81.25,5.5 81.75,6 114.25,6 132,23.75 132,30.25 135.25,30.25 136.25,31.25 JP3.15
N$1
  Bottom 0.152: R1.2 108.75,41 108.75,43 J1.3
N$2
  Bottom 0.152: R2.2 101.75,41 101.75,43 J1.5
N$3
  Bottom 0.152: R3.2 81.75,40.75 81.75,43 J2.3
N$4
  Bottom 0.152: R4.2 74.75,40.75 74.75,43 J2.5
N$5
  Bottom 0.152: R5.2 55,40.75 55,43 J3.3
N$6
  Bottom 0.152: R6.2 48,40.75 48,43 J3.5
N$7
  Bottom 0.152: R7.2 28.75,40.25 28.75,43 J4.3
N$8
  Bottom 0.152: R8.2 21.5,40.5 21.5,43 J4.5
N$9
  Bottom 0.152: R9.2 108.75,20.5 108.75,22.75 J5.3
N$10
  Bottom 0.152: R10.2 101.75,20.5 101.75,22.75 J5.5
N$11
  Bottom 0.152: R11.2 81.75,20.75 81.75,22.75 J6.3
N$12
  Bottom 0.152: R12.2 74.75,20.75 74.75,22.75 J6.5
N$13
  Bottom 0.152: R13.2 55,20.5 55,22.75 J7.3
N$14
  Bottom 0.152: R14.2 48,20.75 48,22.75 J7.5
N$15
  Bottom 0.152: R15.2 28.75,20.75 28.75,22.75 J8.3
N$16
  Bottom 0.152: R16.2 21.75,20.75 21.75,22.75 J8.5
N$17
  Bottom 0.152: R25.1 100.94,35.31 U1.1
N$18
  Bottom 0.152: R25.3 97.92,31.71 R25.2 100.99,30.38 U1.8
N$19
  Bottom 0.152: U2.1 75.03,35.13 R17.1
N$20
  Bottom 0.152: U2.8 75.06,30.2 R17.2 72,31.52 R17.3
N$21
  Bottom 0.152: U3.1 47.57,35.2 R18.1
N$22
  Bottom 0.152: U3.8 47.7,30.28 R18.2 44.59,31.65 R18.3
N$23
  Bottom 0.152: U4.1 21.16,34.67 R19.1
N$24
  Bottom 0.152: U4.8 21.18,29.74 R19.2 18.12,31.06 R19.3
N$25
  Bottom 0.152: U5.1 100.47,14.81 R20.1
N$26
  Bottom 0.152: U5.8 100.95,9.88 R20.2 97.66,11.43 R20.3
N$27
  Bottom 0.152: U6.1 74.92,15.75 R21.1
N$28
  Bottom 0.152: U6.8 72.54,13.2 R21.2 70.8,13.44 R21.3
N$29  (via drill 0.35)
  Top 0.152: v49,13.25 48.75,13.5 v48.75,15.5
  Bottom 0.152: v48.75,15.5 49,15.25 49.5,15.25 U7.1 | v49,13.25 46.05,13.25 R22.1
N$30
  Bottom 0.152: U7.8 48.5,11.42 R22.2 43.83,11.42 R22.3
N$31
  Bottom 0.152: U8.1 21.08,15.01 R23.1
N$32
  Bottom 0.152: U8.8 20.93,10.08 R23.2 17.96,11.32 R23.3
SIG1+
  Bottom 0.152: C10.1 103.75,45.42 103.75,41 104,41 C1.2 104,40.75 103.5,40.75 101.75,39 R2.1 101.5,38.75 103.74,36.51 103.74,34.26 104.25,33.75 105.5,33.75 105.5,35.25 U1.3
SIG1-
  Bottom 0.152: C9.1 106.5,46.5 106.5,41 106,41 C1.1 106,40.75 107.75,39 108.5,39 R1.1 108.5,38.75 107.75,38.75 106,37 104.5,37 104.5,35.5 U1.2
SIG2+
  Bottom 0.152: C12.1 75.75,46.5 75.75,43.75 77.75,41.75 77.75,40.75 77.5,40.75 C2.2 77.25,40.5 77,40.5 75.75,39.25 75.25,39.25 75,39 R4.1 75,38.75 75.75,38.75 77.75,36.75 79,36.75 79,35.25 U2.3
SIG2-
  Bottom 0.152: C11.1 80.25,46.5 80.25,40.75 79.5,40.75 C2.1 79.5,40.5 81.25,38.75 81.75,38.75 R3.1 81.75,38.5 80.75,38.5 79.75,37.5 79.63,37.5 79.63,34.13 79,33.5 77.75,33.5 77.75,35 U2.2
SIG3+
  Bottom 0.152: C14.1 50.75,46.8 50.75,41.75 C3.2 50.5,41.5 50.5,41 48.25,38.75 R6.1 48.25,38.5 49.25,38.5 49.75,38 50.4,38 50.4,34.1 50.73,33.77 52.25,33.77 52.25,35 U3.3
SIG3-
  Bottom 0.152: 54.75,39 55,39 R5.1 54.75,39 | 54.75,39 53.74,39 53.74,40.55 C3.1 52.5,41.75 52.5,45.25 54.25,47 C13.1 | 54.75,39 52.5,36.75 51,36.75 51,35.25 U3.2
SIG4+
  Bottom 0.152: C16.1 24,44.92 24,41.5 C4.2 24.25,41.25 21.5,38.5 R8.1 21.5,38.25 22.5,38.25 24,36.75 26,36.75 26,34.75 U4.3
SIG4-
  Bottom 0.152: 26.63,38.5 28.25,38.5 28.5,38.25 R7.1 | 26.63,38.5 26.25,38.5 26.25,41.25 C4.1 26,41.5 25.75,41.5 25.75,44.5 27.5,46.25 C15.1 | 26.63,38.5 26.63,33.63 26,33 24.75,33 24.75,34.5 U4.2
SIG5+
  Bottom 0.152: C18.1 102.75,26.25 102.75,23 104.5,21.25 104.5,20.5 104.25,20.5 C5.2 104.25,20.25 103,19 102.25,19 101.75,18.5 R10.1 101.75,18.25 102.25,18.25 104,16.5 105.75,16.5 105.75,15 U5.3
SIG5-
  Bottom 0.152: 108.25,18.5 108.5,18.5 R9.1 108.25,18.5 | 108.25,18.5 108,18.5 106.25,20.25 C5.1 106.25,20.5 106.25,22 107.25,23 107.5,23 107.5,26.25 C17.1 | 108.25,18.5 108.25,14.5 106.75,13 104.25,13 104.25,14.75 U5.2
SIG6+
  Bottom 0.152: 75.25,19 75,18.75 R12.1 75.25,19 | 75.25,19 76,19 77.5,20.5 C6.2 77.25,20.75 77.25,22.5 75.75,24 75.75,26.25 C20.1 | 75.25,19 78,16.25 79,16.25 79,14.5 U6.3
SIG6-
  Bottom 0.152: 81.25,18.75 79.5,20.5 C6.1 79.5,20.75 79.5,21.5 80.75,22.75 80.75,26.25 C19.1 | 81.25,18.75 81.75,18.75 R11.1 81.25,18.75 | 81.25,18.75 79.75,17.25 79.56,17.25 79.56,13.31 79,12.75 77.75,12.75 77.75,14.25 U6.2
SIG7+  (via drill 0.35)
  Top 0.152: v50.5,22 v50.5,25.5
  Bottom 0.152: v50.5,25.5 50,25.5 49.25,26.25 C22.1 | v50.5,22 50.5,20.75 50.75,20.75 C7.2 50.75,20.5 50,20.5 48.25,18.75 R14.1 48.25,18.5 50.37,18.5 50.37,14.13 50.75,13.75 52.25,13.75 52.25,15 U7.3
SIG7-
  Bottom 0.152: 54.5,18.75 52.75,20.5 C7.1 52.75,20.75 54,20.75 54,26.25 C21.1 | 54.5,18.75 55,18.75 R13.1 54.5,18.75 | 54.5,18.75 52.5,16.75 51,16.75 51,15.25 U7.2
SIG8+
  Bottom 0.152: C24.1 22.5,26.25 22.5,23.5 23.75,22.25 23.75,20.75 24,20.75 C8.2 24,20.5 22.5,19 22,19 21.75,18.75 R16.1 21.75,18.5 22.76,18.5 24.51,16.75 25.63,16.75 U8.3
SIG8-
  Bottom 0.152: 27.75,18.75 27.62,18.88 26,20.5 C8.1 25.75,20.75 25.75,24.5 27.5,26.25 C23.1 | 27.75,18.75 27.77,18.73 26.25,17.22 26.25,14 25.75,13.5 24.5,13.5 24.5,15 U8.2 | 27.75,18.75 28.5,18.75 R15.1

### Text on the board
tPlace: +EXC4 | +SEN4 | +SIG4 | SHLD | -SIG4 | -SEN4 | -EXC4 | +EXC3 | +SEN3 | +SIG3 | SHLD | -SIG3 | -SEN3 | -EXC3 | +EXC2 | +SEN2 | +SIG2 | SHLD | -SIG2 | -SEN2 | -EXC2 | +EXC1 | +SEN1 | +SIG1 | SHLD | -SIG1 | -SEN1 | -EXC1 | +EXC8 | +SEN8 | +SIG8 | SHLD | -SIG8 | -SEN8 | -EXC8 | +EXC7 | +SEN7 | +SIG7 | SHLD | -SIG7 | -SEN7 | -EXC7 | +EXC6 | +SEN6 | +SIG6 | SHLD | -SIG6 | -SEN6 | -EXC6 | +EXC5 | +SEN5 | +SIG5 | SHLD | -SIG5 | -SEN5 | -EXC5 | AGND | Tarjeta de Celdas de Carga | ver 1.0